# Altium schematic sheet Light Control Compact.SchDoc: Light Control Compact
size A4; Revision: DRAFT; SheetNumber: 1; SheetTotal: 1; ProjectName: Light Control Compact
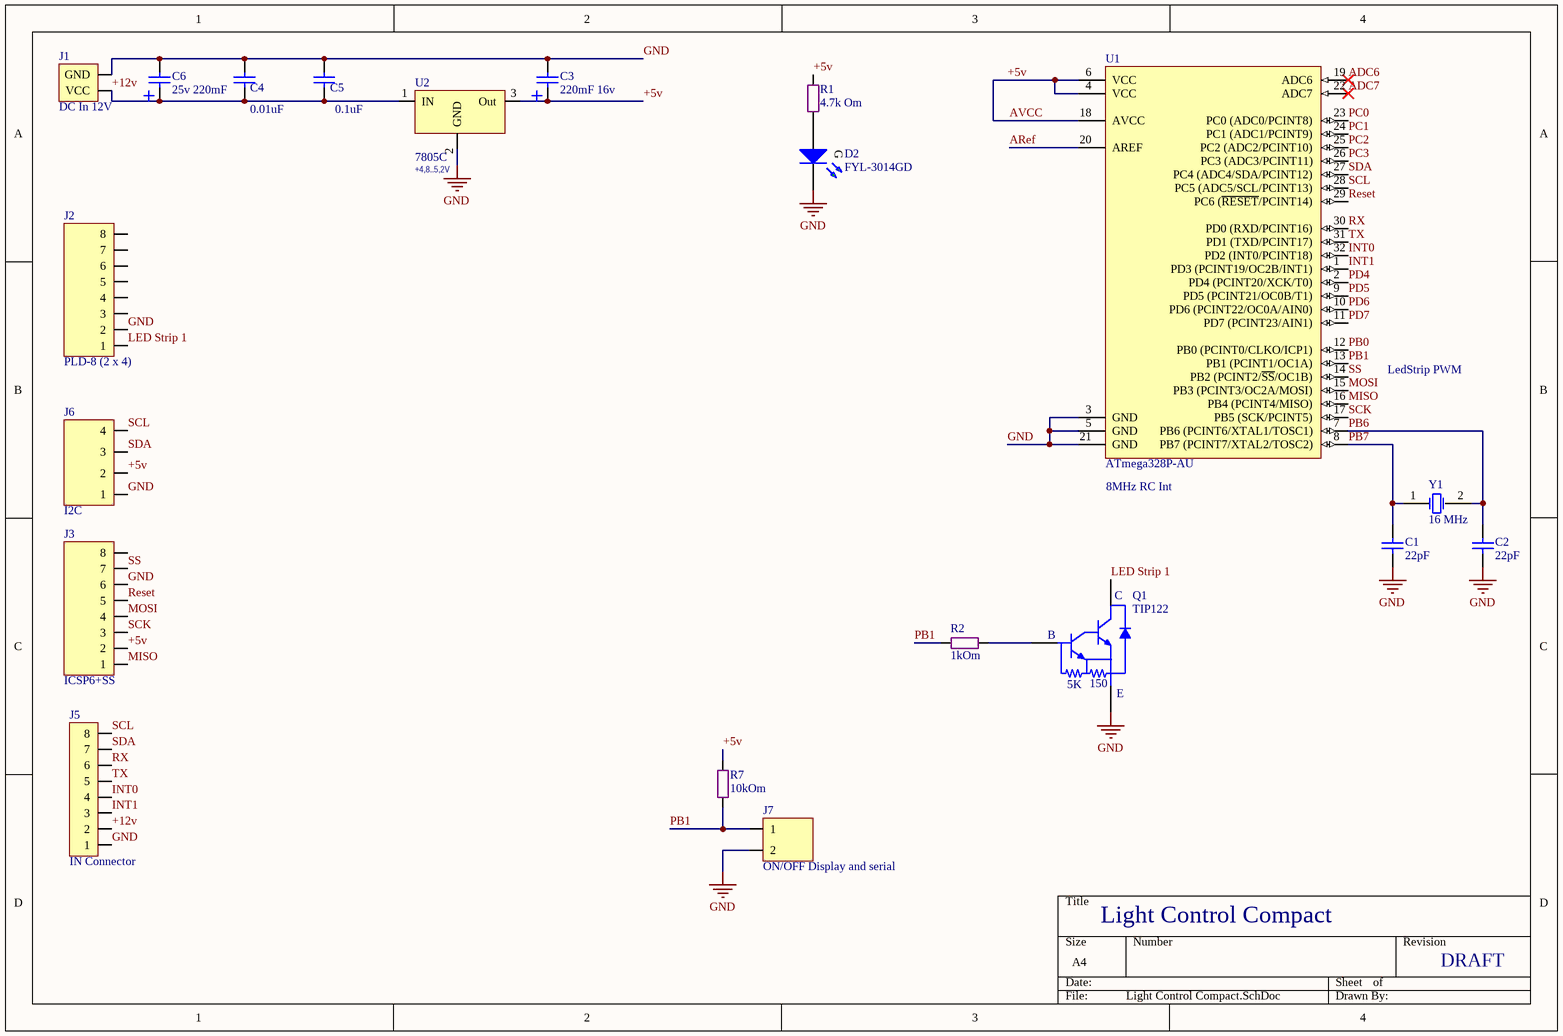
[diagram p0: Light Control Compact.SchDoc]

## Parts
C1  22pF  [SMD 0805 (2012)]
C2  22pF  [SMD 0805 (2012)]
C3  220mF 16v  [Cap E p2mm D6.5xH11]
C4  0.01uF  [SMD 0805 (2012)]
C5  0.1uF  [SMD 0805 (2012)]
C6  25v 220mF  [Cap E p2mm D6.5xH11]
D2  FYL-3014GD  [LED Round 3mm Green]
J1  DC In 12V  [DC Connector]
J2  PLD-8 (2 x 4)  [Line 2.54 X 8D (2 x 4)]
J3  ICSP6+SS  [Line 2.54 X 8D (2 x 4)]
J5  IN Connector  [Molex Micro-Fit 3.0 - 8 pin D R]
J6  I2C  [Line 2.54 X 4]
J7  ON/OFF Display and serial  [Line 2.54 x 2]
Q1  TIP122  [TO220-2]
R1  4.7k Om  [SMD 0805 (2012)]
R2  1kOm  [SMD 0805 (2012)]
R7  10kOm  [SMD 0805 (2012)]
U1  ATmega328P-AU  [32A_N]
U2  7805C  V Out: +4,8..5,2V  [D-PAK]
Y1  16 MHz  [XTAL - 2]

## Nets
GND: C1.1 C2.1 C3.2 C4.1 C5.1 C6.2 D2.K J1.GND J2.2 J3.6 J5.1 J6.1 J7.2 Q1.3(E) U1.3(GND) U1.5(GND) U1.21(GND) U2.2(GND)
+5v: C3.1 J3.2 J6.2 R1.1 R7.2 U1.4(VCC) U1.6(VCC) U1.18(AVCC) U2.3(Out)  [also labelled AVCC]
+12v: C4.2 C5.2 C6.1 J1.VCC J5.2 U2.1(IN)
ADC6: U1.19(ADC6)
ADC7: U1.22(ADC7)
ARef: U1.20(AREF)
INT0: J5.4 U1.32(PD2_(INT0/PCINT18))
INT1: J5.3 U1.1(PD3_(PCINT19/OC2B/INT1))
LED Strip 1: J2.1 Q1.2(C)
MISO: J3.1 U1.16(PB4_(PCINT4/MISO))
MOSI: J3.4 U1.15(PB3_(PCINT3/OC2A/MOSI))
PB0: U1.12(PB0_(PCINT0/CLKO/ICP1))
PB1: J7.1 R2.1 R7.1 U1.13(PB1_(PCINT1/OC1A))
PB6: C2.2 U1.7(PB6_(PCINT6/XTAL1/TOSC1)) Y1.2(OSC2)
PB7: C1.2 U1.8(PB7_(PCINT7/XTAL2/TOSC2)) Y1.1(OSC1)
PC0: U1.23(PC0_(ADC0/PCINT8))
PC1: U1.24(PC1_(ADC1/PCINT9))
PC2: U1.25(PC2_(ADC2/PCINT10))
PC3: U1.26(PC3_(ADC3/PCINT11))
PD4: U1.2(PD4_(PCINT20/XCK/T0))
PD5: U1.9(PD5_(PCINT21/OC0B/T1))
PD6: U1.10(PD6_(PCINT22/OC0A/AIN0))
PD7: U1.11(PD7_(PCINT23/AIN1))
Reset: J3.5 U1.29(PC6_(~{RESET}/PCINT14))
RX: J5.6 U1.30(PD0_(RXD/PCINT16))
SCK: J3.3 U1.17(PB5_(SCK/PCINT5))
SCL: J5.8 J6.4 U1.28(PC5_(ADC5/SCL/PCINT13))
SDA: J5.7 J6.3 U1.27(PC4_(ADC4/SDA/PCINT12))
SS: J3.7 U1.14(PB2_(PCINT2/~{SS}/OC1B))
TX: J5.5 U1.31(PD1_(TXD/PCINT17))
NetD2_A: D2.A R1.2
NetQ1_1: Q1.1(B) R2.2

Not connected (* = marked no-connect by the designer): J2 3 4 5 6 7 8; J3 8

## Notes on the sheet
- LedStrip PWM
- (near U1) 8MHz RC Int
- (in symbol Led Round 3mm Green) G
- (in symbol TIP122) 5K; 150

## Library data of the parts
C1 C2 C4 C5 = Cap SMD 0402-1812: Capacitor
C3 = Cap E 220mF x 16V: Capacitor; Value: 220mF 16v
C6 = Cap E 220mF x 16V: Capacitor; Value: 220mF 16v
D2 = Led Round 3mm Green: 2.1v 10mA, 15-30mCd; Forward Voltage Max: 2.3; Forward Voltage TYP: 2.1; Wave len min/typ: 570nm; Liminous Typ (mcd): 15-30; Forward Amp (mA): 10; Color: Green; Name: FYL-3014GD
J1 = DC Connector (PJ-002B): DC Connector; Ext Pin Diameter: 5.5mm; Int Pin Diameter: 2.5
J2 J3 = PLD-8 (2 x 4): Vert, Sgl line, Male
J5 = Micro-Fit 8R (2x4): Horisontal, Dbl line, Male - 3mm
J6 = PLS-4: Vert, Sgl line, Male
J7 = PLS-2: Vert, Sgl line, Male
Q1 = TIP122: NPN Darlington 5A, 65W, 100V, h>1000; I imp: 8A; h21e: >1000; Code_JEDEC: TO-220; U max: 100V; I max: 5A; P max: 65W; Channnel: NPN
R1 R2 R7 = Res All Types
U1 = ATmega328P-AU: 8-bit AVR Microcontroller, 32KB Flash, 1KB EEPROM, 2KB SRAM, 32-pin TQFP, Industrial Grade (-40°C to 85°C); Published: 1-Apr-2010; DatasheetVersion: revA, Jan-2010; PackageVersion: revB, Oct-2001; PackageReference: 32A; Publisher: Altium Limited; PackageDescription: 32-Lead, 7x7x1.0 mm Body, 0.8mm Lead Pitch, Thin Profile Plastic Quad Flat Package (TQFP); Supplier 1: Digi-Key; Supplier Part Number 1: ATMEGA328P-AU-ND; Supplier 2: Farnell; Supplier Part Number 2: 1715486; Supplier 3: Mouser; Supplier Part Number 3: 556-ATMEGA328P-AU; Code_JEDEC: MS-026-ABA; ComponentLink1Description: Manufacturer Link; ComponentLink1URL: http://www.atmel.com/products/avr/default.asp?; ComponentLink2Description: ATmega48A/48PA/88A/88PA/168A/168PA/328/328P Datasheet; ComponentLink2URL: http://www.atmel.com/dyn/resources/prod_documents/8271.pdf; ComponentLink3Description: ATmega48A/48PA/88A/88PA/168A/168PA/328/328P Summary; ComponentLink3URL: http://www.atmel.com/dyn/resources/prod_documents/8271S.pdf; ComponentLink4Description: Atmel.com Home; ComponentLink4URL: http://www.atmel.com
U2 = 7805C: Voltage Regulator; Manufacturer: Интеграл; I output (A): 1; Max Voltage In (V): 35; Напряжение выход-вход (dropout): >2V; t: -10..+70°C; Case: D2PAK; Shema: http://tec.org.ru/_bd/5/57349922.jpg; Name: 7805C
Y1 = XTAL: Crystal Oscillator; Published: 8-Jun-2000; LatestRevisionDate: 17-Jul-2002; LatestRevisionNote: Re-released for DXP Platform.; PackageReference: R38; Publisher: Altium Limited; PackageDescription: Crystal, Thru-Hole; 2 Leads; Body 3.1 x 8.2 mm (Dia.xH)